# Altium schematic sheet Launchpad.SchDoc
size A
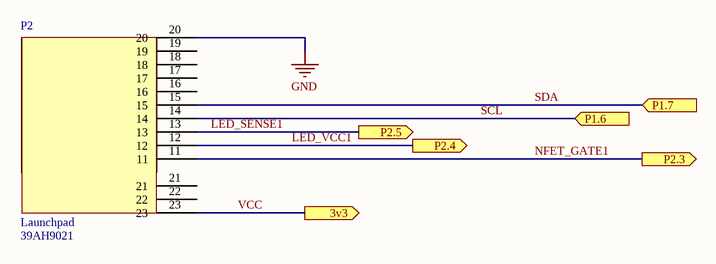
[diagram p0: Launchpad.SchDoc]

## Parts
P2  Launchpad  Supplier Part Number 1: 39AH9021  [MSP430 Launchpad]

## Ports
3v3 (out), P1.6 (in), P1.7 (in), P2.3 (out), P2.4 (out), P2.5 (out)

## Nets
GND: P2.20
LED_SENSE1: P2.13 ; port P2.5
LED_VCC1: P2.12 ; port P2.4
NFET_GATE1: P2.11 ; port P2.3
SCL: P2.14 ; port P1.6
SDA: P2.15 ; port P1.7
VCC: P2.23 ; port 3v3

Not connected (* = marked no-connect by the designer): P2 16 17 18 19 21 22

## Library data of the parts
P2 = Launchpad: MSP430G2XX, LAUNCHPAD, FLASH EMULATION, DEV KIT; Manufacturer: Texas Instruments; Manufacturer Part Number: MSP-EXP430G2; Core Architecture: MSP430; Evaluation Kit: Yes; Interface: USB; Data Bus Width: 16b; Number of Bits: 16; Supplier 1: Newark; RoHS: Yes; Category: Embedded Processors and Controllers; Mount: Socket; Number of Pins: 0.7; Weight: 0.22lb; Packaging: Bulk; Package Quantity: 1; Length: 3.94inch; Height: 1.97inch; Width: 3.94inch; Radiation Hardening: No; REACH SVHC: No SVHC; ComponentLink1URL: https://datasheet.ciiva.com/2398/slay017-2398228.pdf?src-supplier=Digi-Key; ComponentLink1Description: https://datasheet.ciiva.com/2398/slay017-2398228.pdf?src-supplier=Digi-Key; ComponentLink2URL: https://datasheet.ciiva.com/27059/2207275-27059764.pdf?src-supplier=Jameco; ComponentLink2Description: https://datasheet.ciiva.com/27059/2207275-27059764.pdf?src-supplier=Jameco; ComponentLink3URL: https://datasheet.ciiva.com/20167/73-4724-20167738.pdf?src-supplier=Rapid+Electronics; ComponentLink3Description: https://datasheet.ciiva.com/20167/73-4724-20167738.pdf?src-supplier=Rapid+Electronics; ComponentLink4URL: https://datasheet.ciiva.com/26344/414784-da-01-en-launchpad-devel-tool-msp-exp430g2-tid-26344585.pdf?src-supplier=Conrad; ComponentLink4Description: https://datasheet.ciiva.com/26344/414784-da-01-en-launchpad-devel-tool-msp-exp430g2-tid-26344585.pdf?src-supplier=Conrad